# Altium schematic sheet PISCES_200.SchDoc
size A3
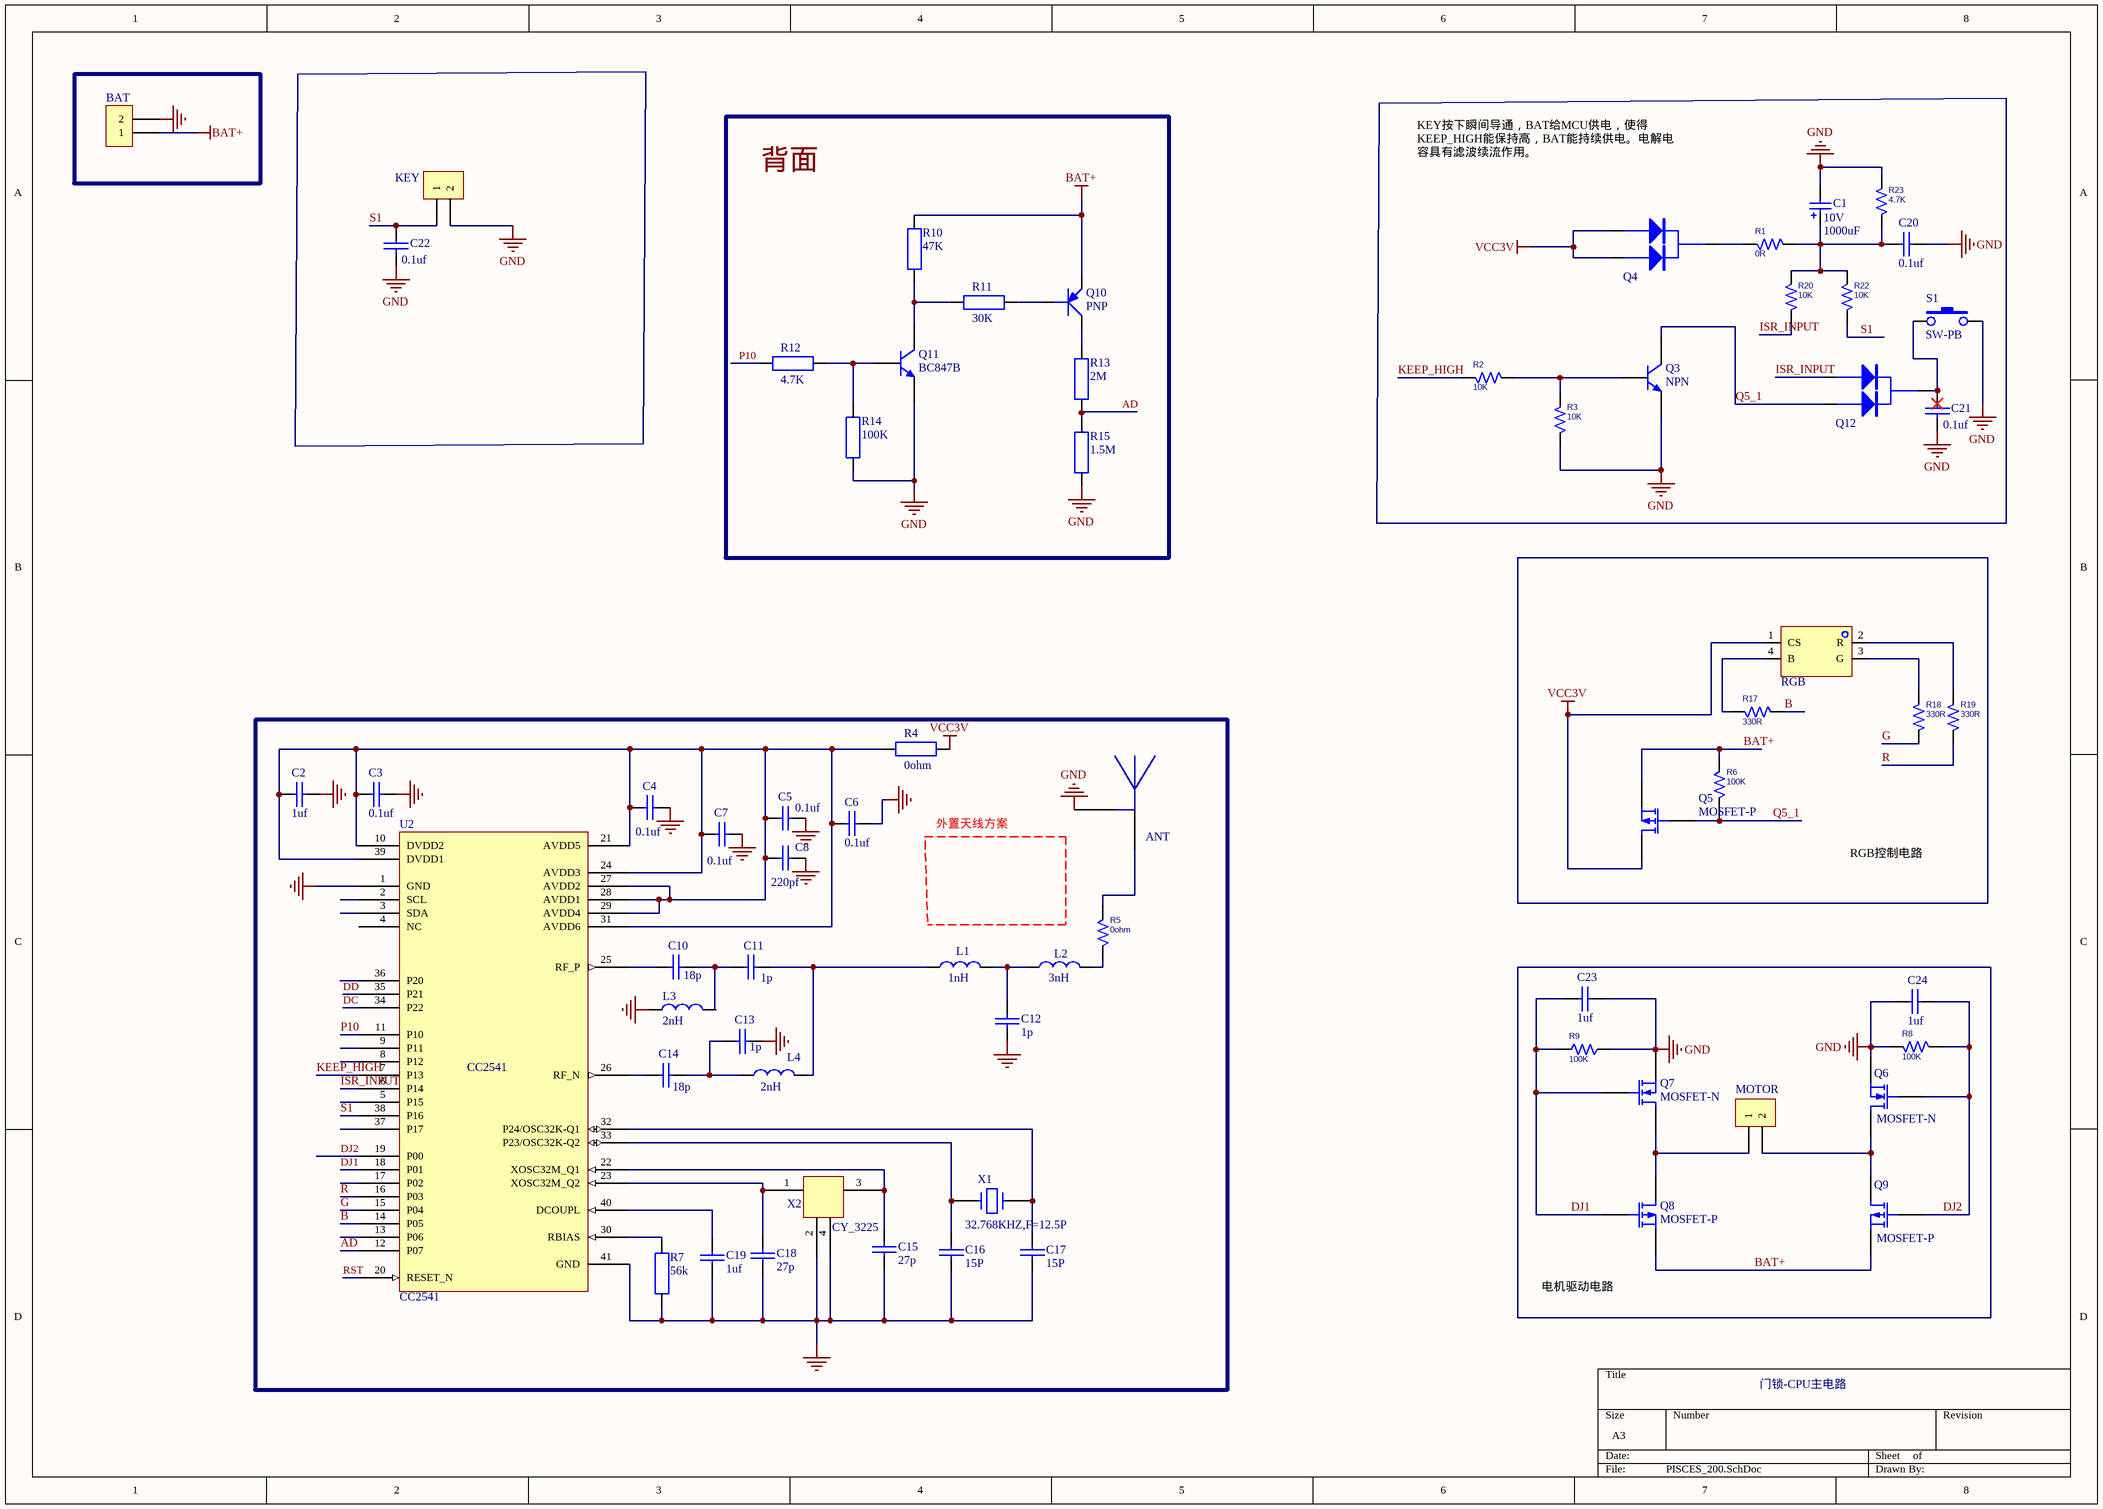
[diagram p0: PISCES_200.SchDoc]

## Parts
ANT  ANT  [ANT]  (value not drawn)
BAT  CN1  [2PAD]  (value not drawn)
C1  10V  value 1000uF  [CAT_ELE]
C2  1uf  [PC5-*****-**-0A_0603_TDK]
C3  0.1uf  [PC5-*****-**-0A_0603_TDK]
C4  0.1uf  [PC5-*****-**-0A_0603_TDK]
C5  0.1uf  [PC7-*****-KQA0A_0402_YAGEO]
C6  0.1uf  [PC7-*****-KQA0A_0402_YAGEO]
C7  0.1uf  [PC7-*****-KQA0A_0402_YAGEO]
C8  220pf  [PC7-*****-KQA0A_0402_YAGEO]
C10  18p  [PC7-*****-KQA0A_0402_YAGEO]
C11  1p  [PC7-*****-KQA0A_0402_YAGEO]
C12  1p  [PC7-*****-KQA0A_0402_YAGEO]
C13  1p  [PC7-*****-KQA0A_0402_YAGEO]
C14  18p  [PC7-*****-KQA0A_0402_YAGEO]
C15  27p  [PC7-*****-KO-0A_0603_TDK]
C16  15P  [PC5-*****-**-0A_0603_TDK]
C17  15P  [PC7-*****-KO-0A_0603_TDK]
C18  27p  [PC7-*****-KO-0A_0603_TDK]
C19  1uf  [PC5-*****-**-0A_0603_TDK]
C20  0.1uf  [PC7-*****-KQA0A_0402_YAGEO]
C21  0.1uf  [PC7-*****-KQA0A_0402_YAGEO]
C22  0.1uf  [PC7-*****-KQA0A_0402_YAGEO]
C23  1uf  [PC7-*****-KO-0A_0603_TDK]
C24  1uf  [PC7-*****-KO-0A_0603_TDK]
KEY  CN1  [KEY_2P]  (value not drawn)
L1  1nH  [PC5-*****-**-0A_0402_TDK]
L2  3nH  [PC5-*****-**-0A_0402_TDK]
L3  2nH  [PC5-*****-**-0A_0402_TDK]
L4  2nH  [PC5-*****-**-0A_0402_TDK]
MOTOR  CN1  [2PAD]  (value not drawn)
Q3  NPN  [SOT-23]
Q4  Q4  [SOT-23]
Q5  MOSFET-P  [SOT-23]
Q6  MOSFET-N  [SOT-23]
Q7  MOSFET-N  [SOT-23]
Q8  MOSFET-P  [SOT-23]
Q9  MOSFET-P  [SOT-23]
Q10  PNP  [SOT-23]
Q11  BC847B  [SOT-23]
Q12  Q12  [SOT-23]
R1  0R  [PC7-*****-KQA0A_0402_YAGEO]
R2  10K  [PC7-*****-KQA0A_0402_YAGEO]
R3  10K  [PC7-*****-KQA0A_0402_YAGEO]
R4  0ohm  [PC7-*****-KQA0A_0402_YAGEO]
R5  0ohm  [PC7-*****-KQA0A_0402_YAGEO]
R6  100K  [PC7-*****-KQA0A_0402_YAGEO]
R7  56k  [PRC-*****-BM-0A_0402]
R8  100K  [PC7-*****-KQA0A_0402_YAGEO]
R9  100K  [PC7-*****-KQA0A_0402_YAGEO]
R10  47K  [PC7-*****-KQA0A_0402_YAGEO]
R11  30K  [PC7-*****-KQA0A_0402_YAGEO]
R12  4.7K  [PC7-*****-KQA0A_0402_YAGEO]
R13  2M  [PC7-*****-KQA0A_0402_YAGEO]
R14  100K  [PC7-*****-KQA0A_0402_YAGEO]
R15  1.5M  [PC7-*****-KQA0A_0402_YAGEO]
R17  330R  [PC7-*****-KQA0A_0402_YAGEO]
R18  330R  [PC7-*****-KQA0A_0402_YAGEO]
R19  330R  [PC7-*****-KQA0A_0402_YAGEO]
R20  10K  [PC7-*****-KQA0A_0402_YAGEO]
R22  10K  [PC7-*****-KQA0A_0402_YAGEO]
R23  4.7K  [PC7-*****-KQA0A_0402_YAGEO]
RGB  RGB
S1  SW-PB  [TS-030]
U2  CC2541  [CC2530_QFN40]
X1  32.768KHZ,F=12.5P  [FC-135]
X2  CY_3225  [CY_3225]

## Blocks framed on the sheet
外置天线方案: ANT C2-C8 C10-C19 L1-L4 R4 R5 R7 U2 X1 X2

## Nets
BAT+: BAT.1 Q5.2(S) Q8.2(S) Q9.2(S) Q10.2 R6.1 R10.2
GND: ANT.2 BAT.2 C1.2 C2.2 C3.2 C4.2 C5.2 C6.2 C7.2 C8.1 C12.1 C13.2 C15.1 C16.1 C17.1 C18.1 C19.1 C20.2 C21.2 C22.2 C23.2 C24.1 KEY.2 L3.1 Q3.2 Q6.2(S) Q7.2(S) Q11.2 R3.2 R7.2 R8.2 R9.2 R14.1 R15.1 R23.2 S1.2 U2.1(GND) U2.41(GND) X2.2 X2.4
VCC3V: Q4.1 Q4.2 Q5.3(D) R4.2 RGB.1(CS)
AD: R13.1 R15.2 U2.12(P07)
B: R17.2 U2.14(P05)
DC: U2.34(P22)
DD: U2.35(P21)
DJ1: C23.1 Q7.1(G) Q8.1(G) R9.1 U2.18(P01)
DJ2: C24.2 Q6.1(G) Q9.1(G) R8.1 U2.19(P00)
G: R18.2 U2.15(P04)
ISR_INPUT: Q12.1 R20.1 U2.6(P14)
KEEP_HIGH: R2.1 U2.7(P13)
P10: R12.1 U2.11(P10)
Q5_1: Q3.3 Q5.1(G) Q12.2 R6.2
R: R19.2 U2.16(P03)
RST: U2.20(RESET_N)
S1: C22.1 KEY.1 R22.1 U2.38(P16)
NetANT_1: ANT.1 R5.1
NetC1_1: C1.1 C20.1 R1.2 R20.2 R22.2 R23.1
NetC2_1: C2.1 C3.1 C4.1 C5.1 C6.1 C7.1 C8.2 R4.1 U2.10(DVDD2) U2.21(AVDD5) U2.24(AVDD3) U2.27(AVDD2) U2.28(AVDD1) U2.29(AVDD4) U2.31(AVDD6) U2.39(DVDD1)
NetC10_1: C10.1 U2.25(RF_P)
NetC10_2: C10.2 C11.1 L3.2
NetC11_2: C11.2 L1.1 L4.2
NetC12_2: C12.2 L1.2 L2.1
NetC13_1: C13.1 C14.2 L4.1
NetC14_1: C14.1 U2.26(RF_N)
NetC15_2: C15.2 U2.22(XOSC32M_Q1) X2.3
NetC16_2: C16.2 U2.33(P23/OSC32K-Q2) X1.1
NetC17_2: C17.2 U2.32(P24/OSC32K-Q1) X1.2
NetC18_2: C18.2 U2.23(XOSC32M_Q2) X2.1
NetC19_2: C19.2 U2.40(DCOUPL)
NetC21_1: C21.1 Q12.3 S1.1
NetL2_2: L2.2 R5.2
NetMOTOR_1: MOTOR.1 Q7.3(D) Q8.3(D)
NetMOTOR_2: MOTOR.2 Q6.3(D) Q9.3(D)
NetQ3_1: Q3.1 R2.2 R3.1
NetQ4_3: Q4.3 R1.1
NetQ10_1: Q10.1 R11.2
NetQ10_3: Q10.3 R13.2
NetQ11_1: Q11.1 R12.2 R14.2
NetQ11_3: Q11.3 R10.1 R11.1
NetR7_1: R7.1 U2.30(RBIAS)
NetR17_1: R17.1 RGB.4(B)
NetR18_1: R18.1 RGB.3(G)
NetR19_1: R19.1 RGB.2(R)

Not connected (* = marked no-connect by the designer): U2 2(SCL) 3(SDA) 4(NC) 5(P15) 8(P12) 9(P11) 13(P06) 17(P02) 36(P20) 37(P17)

## Notes on the sheet
- KEY按下瞬间导通，BAT给MCU供电，使得KEEP_HIGH能保持高，BAT能持续供电。电解电容具有滤波续流作用。
- RGB控制电路
- (near Q8) 电机驱动电路
- 门锁-CPU主电路
- Labels drawn without touching a wire or pin: 背面

## Library data of the parts
BAT KEY MOTOR = CON2: Connector
C1 = Cap Pol2: Polarized Capacitor (Axial); Published: 8-Jun-2000; LatestRevisionDate: 17-Jul-2002; LatestRevisionNote: Re-released for DXP Platform.; PackageReference: POLAR0.8; Publisher: Altium Limited; PackageDescription: Polarized Capacitor; 2 Leads
C2-C8 C10-C24 = PC7_0402_YAGEO: PC7-*****-KQA0A
L1-L4 = PWL_18nH: PWL-00195-00-20
Q3 Q11 = NPN: BC847C; Published: 8-Jun-2000; LatestRevisionDate: 17-Jul-2002; LatestRevisionNote: Re-released for DXP Platform.; PackageReference: TO-226-AA; Publisher: Altium Limited; PackageDescription: TO, Flat Index; 3 In-Line, Axial Leads; Body Dia. 4.8mm; Leads 0.55 x 0.51 mm (max); Code_JEDEC: TO-226-AA
Q4 Q12 = BAT54C
Q5 Q8 Q9 = MOSFET-P: P-Channel MOSFET; Published: 8-Jun-2000; LatestRevisionDate: 17-Jul-2002; LatestRevisionNote: Re-released for DXP Platform.; PackageVersion: 1995/1996; PackageReference: E3; Publisher: Altium Limited; PackageDescription: TO, Flat Index; 3 In-Line, Axial Leads; Body Dia. 4.6mm; Lead Dia. 0.5 mm (max)
Q6 Q7 = MOSFET-N: N-Channel MOSFET; Published: 8-Jun-2000; LatestRevisionDate: 17-Jul-2002; LatestRevisionNote: Re-released for DXP Platform.; PackageVersion: 1995/1996; PackageReference: E3; Publisher: Altium Limited; PackageDescription: TO, Flat Index; 3 In-Line, Axial Leads; Body Dia. 4.6mm; Lead Dia. 0.5 mm (max)
Q10 = PNP: BC857C
R1-R3 R5 R6 R8 R9 R17-R20 R22 R23 = R_Dup3: PSpiceTemplate: R^@REFDES %1 %2 ?TOLERANCE|R^@REFDES| @VALUE  ?TOLERANCE|\n.model R^@REFDES RES R=1 DEV=@TOLERANCE%|; Right: 20; Bottom: 20
R4 R7 R10-R15 = PRC_0603: PRC-*****-AM-0A_0603; Text Field1: pristel=\Models.lib
X1 = CRYSTAL